# EAGLE schematic omicron2 (EAGLE 7.0.0)

## Sheet 1 of 5
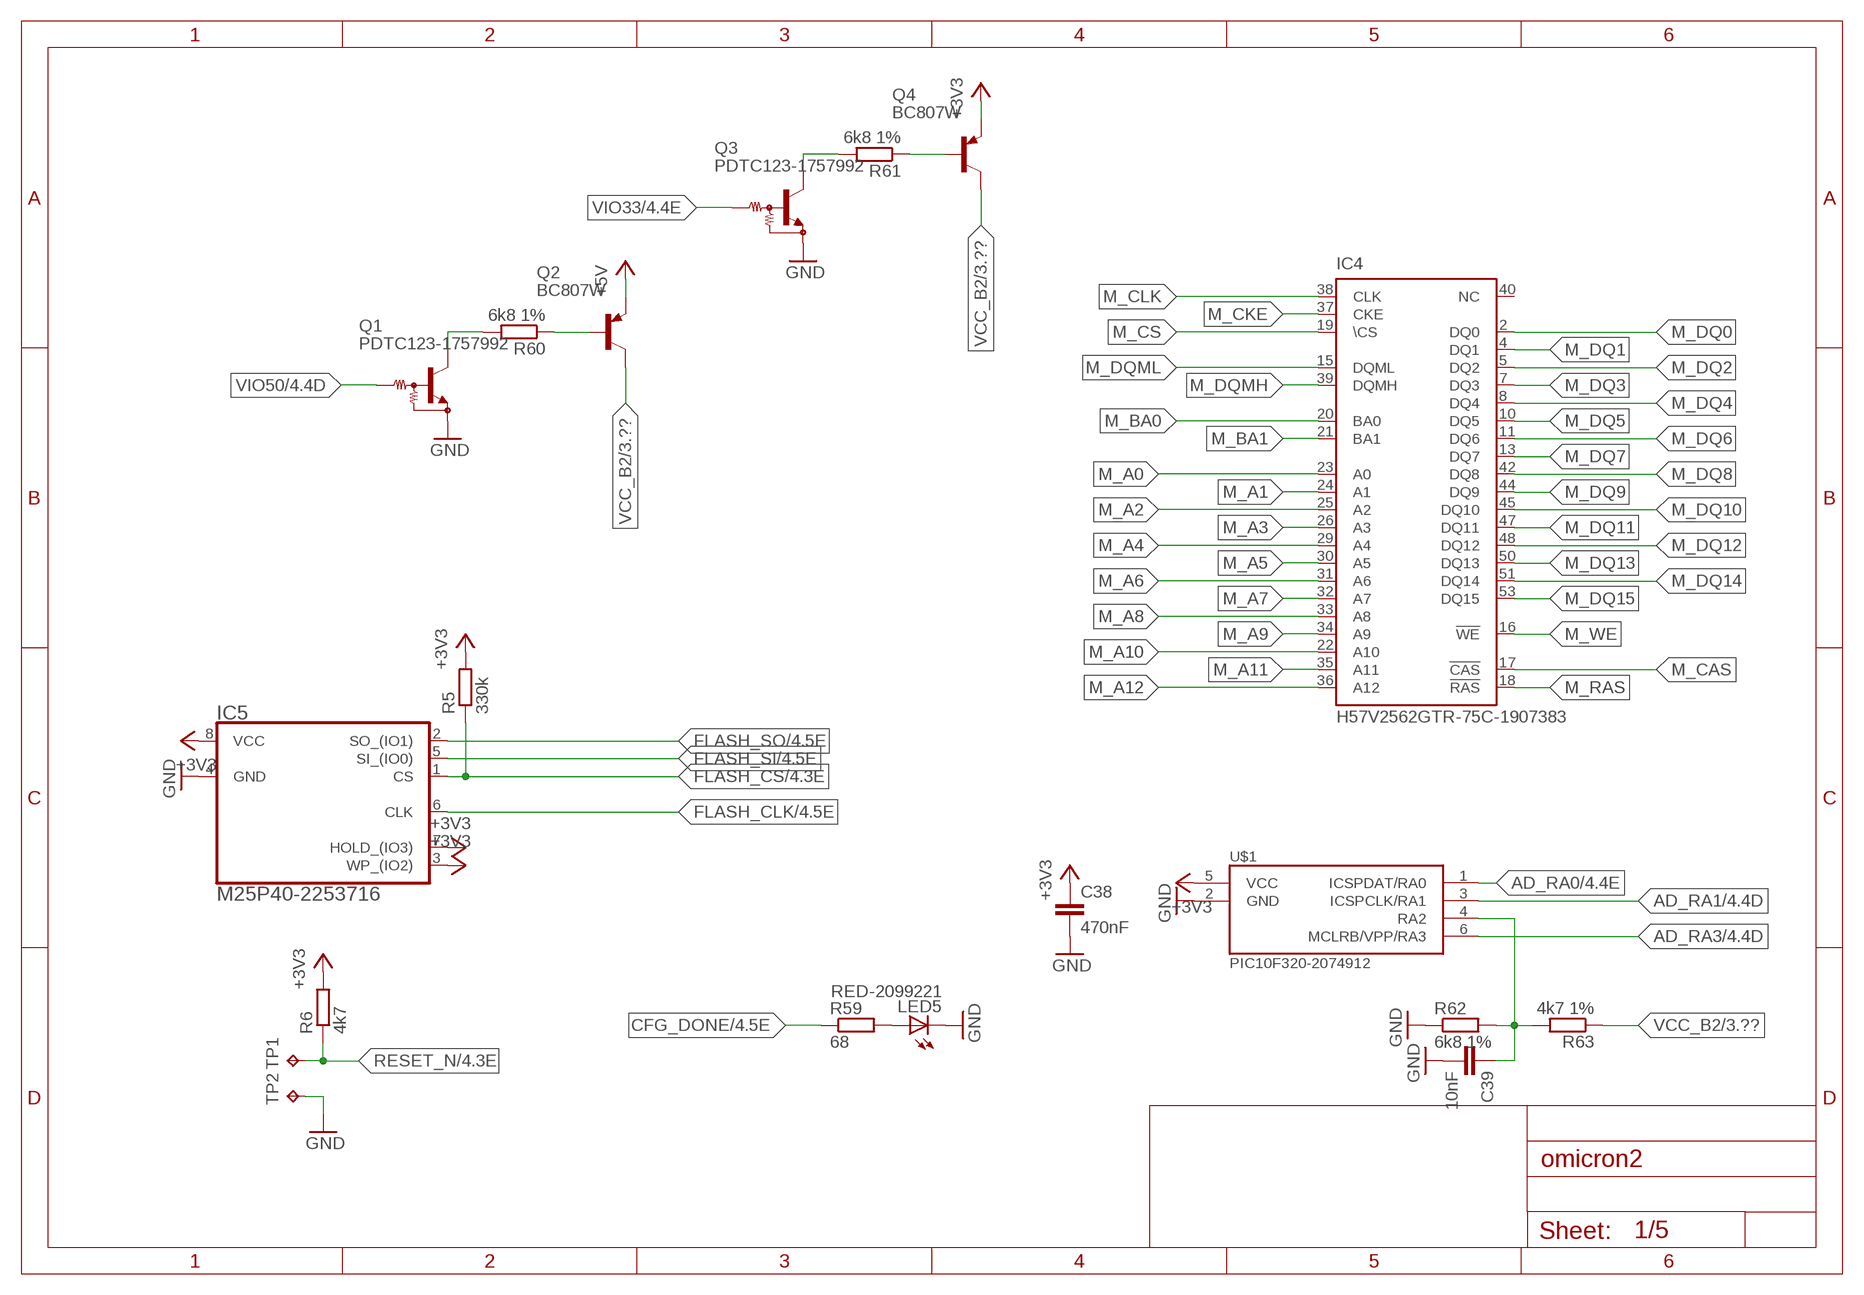
[diagram p0: schematic, sheet 1]

### Parts
C38  470nF  C-EUC0603  [C0603]
C39  10nF  C-EUC0603  [C0603]
IC4  H57V2562GTR-75C-1907383  MT48LC64M4A2  [TSOP54-400]
IC5  M25P40-2253716  FLASH  [SO8]
LED5  RED-2099221  LEDCHIPLED_0603  [CHIPLED_0603]
Q1  PDTC123-1757992  NPN-BIAS-SOT323-BEC  [SOT323]
Q2  BC807W  [SOT323-BEC]
Q3  PDTC123-1757992  NPN-BIAS-SOT323-BEC  [SOT323]
Q4  BC807W  [SOT323-BEC]
R5  330k  R-EU_R0603  [R0603]
R6  4k7  R-EU_R0603  [R0603]
R59  68  R-EU_R0603  [R0603]
R60  6k8 1%  R-EU_R0603  [R0603]
R61  6k8 1%  R-EU_R0603  [R0603]
R62  6k8 1%  R-EU_R0603  [R0603]
R63  4k7 1%  R-EU_R0603  [R0603]
TP1  TPTP15R  [TP15R]
TP2  TPTP20R  [TP20R]
U$1  PIC10F320-2074912  PIC10F320  [SOT23]

### Nets
+3V3: C38.1 IC5.3(WP_(IO2)) IC5.7(HOLD_(IO3)) IC5.8(VCC) Q4.2(E) R5.2 R6.2 U$1.5(VCC) ; also sheet 2,3,4,5
+5V: Q2.2(E) ; also sheet 2,3,5
AD_RA0: U$1.1(ICSPDAT/RA0) ; also sheet 4
AD_RA1: U$1.3(ICSPCLK/RA1) ; also sheet 4
AD_RA3: U$1.6(MCLRB/VPP/RA3) ; also sheet 4
CFG_DONE: R59.1 ; also sheet 4
FLASH_CLK: IC5.6(CLK) ; also sheet 4
FLASH_CS: IC5.1(CS) R5.1 ; also sheet 4
FLASH_SI: IC5.5(SI_(IO0)) ; also sheet 4
FLASH_SO: IC5.2(SO_(IO1)) ; also sheet 4
GND: C38.2 C39.2 IC5.4(GND) LED5.C Q1.2(E) Q3.2(E) R62.1 TP2.TP U$1.2(GND) ; also sheet 2,3,4,5
M_A0: IC4.23(A0) ; also sheet 4
M_A1: IC4.24(A1) ; also sheet 4
M_A2: IC4.25(A2) ; also sheet 4
M_A3: IC4.26(A3) ; also sheet 4
M_A4: IC4.29(A4) ; also sheet 4
M_A5: IC4.30(A5) ; also sheet 4
M_A6: IC4.31(A6) ; also sheet 4
M_A7: IC4.32(A7) ; also sheet 4
M_A8: IC4.33(A8) ; also sheet 4
M_A9: IC4.34(A9) ; also sheet 4
M_A10: IC4.22(A10) ; also sheet 4
M_A11: IC4.35(A11) ; also sheet 4
M_A12: IC4.36(A12) ; also sheet 4
M_BA0: IC4.20(BA0) ; also sheet 4
M_BA1: IC4.21(BA1) ; also sheet 4
M_CAS: IC4.17(!CAS) ; also sheet 4
M_CKE: IC4.37(CKE) ; also sheet 4
M_CLK: IC4.38(CLK) ; also sheet 4
M_CS: IC4.19(\CS) ; also sheet 4
M_DQ0: IC4.2(DQ0) ; also sheet 4
M_DQ1: IC4.4(DQ1) ; also sheet 4
M_DQ2: IC4.5(DQ2) ; also sheet 4
M_DQ3: IC4.7(DQ3) ; also sheet 4
M_DQ4: IC4.8(DQ4) ; also sheet 4
M_DQ5: IC4.10(DQ5) ; also sheet 4
M_DQ6: IC4.11(DQ6) ; also sheet 4
M_DQ7: IC4.13(DQ7) ; also sheet 4
M_DQ8: IC4.42(DQ8) ; also sheet 4
M_DQ9: IC4.44(DQ9) ; also sheet 4
M_DQ10: IC4.45(DQ10) ; also sheet 4
M_DQ11: IC4.47(DQ11) ; also sheet 4
M_DQ12: IC4.48(DQ12) ; also sheet 4
M_DQ13: IC4.50(DQ13) ; also sheet 4
M_DQ14: IC4.51(DQ14) ; also sheet 4
M_DQ15: IC4.53(DQ15) ; also sheet 4
M_DQMH: IC4.39(DQMH) ; also sheet 4
M_DQML: IC4.15(DQML) ; also sheet 4
M_RAS: IC4.18(!RAS) ; also sheet 4
M_WE: IC4.16(!WE) ; also sheet 4
N$4: LED5.A R59.2
N$7: Q2.1(B) R60.1
N$24: Q1.3(C) R60.2
N$25: Q4.1(B) R61.1
N$26: Q3.3(C) R61.2
N$27: C39.1 R62.2 R63.2 U$1.4(RA2)
RESET_N: R6.1 TP1.TP ; also sheet 4
VCC_B2: Q2.3(C) Q4.3(C) R63.1 ; also sheet 3
VIO33: Q3.1(B) ; also sheet 4
VIO50: Q1.1(B) ; also sheet 4
Unconnected: IC4.40(NC)

## Sheet 2 of 5
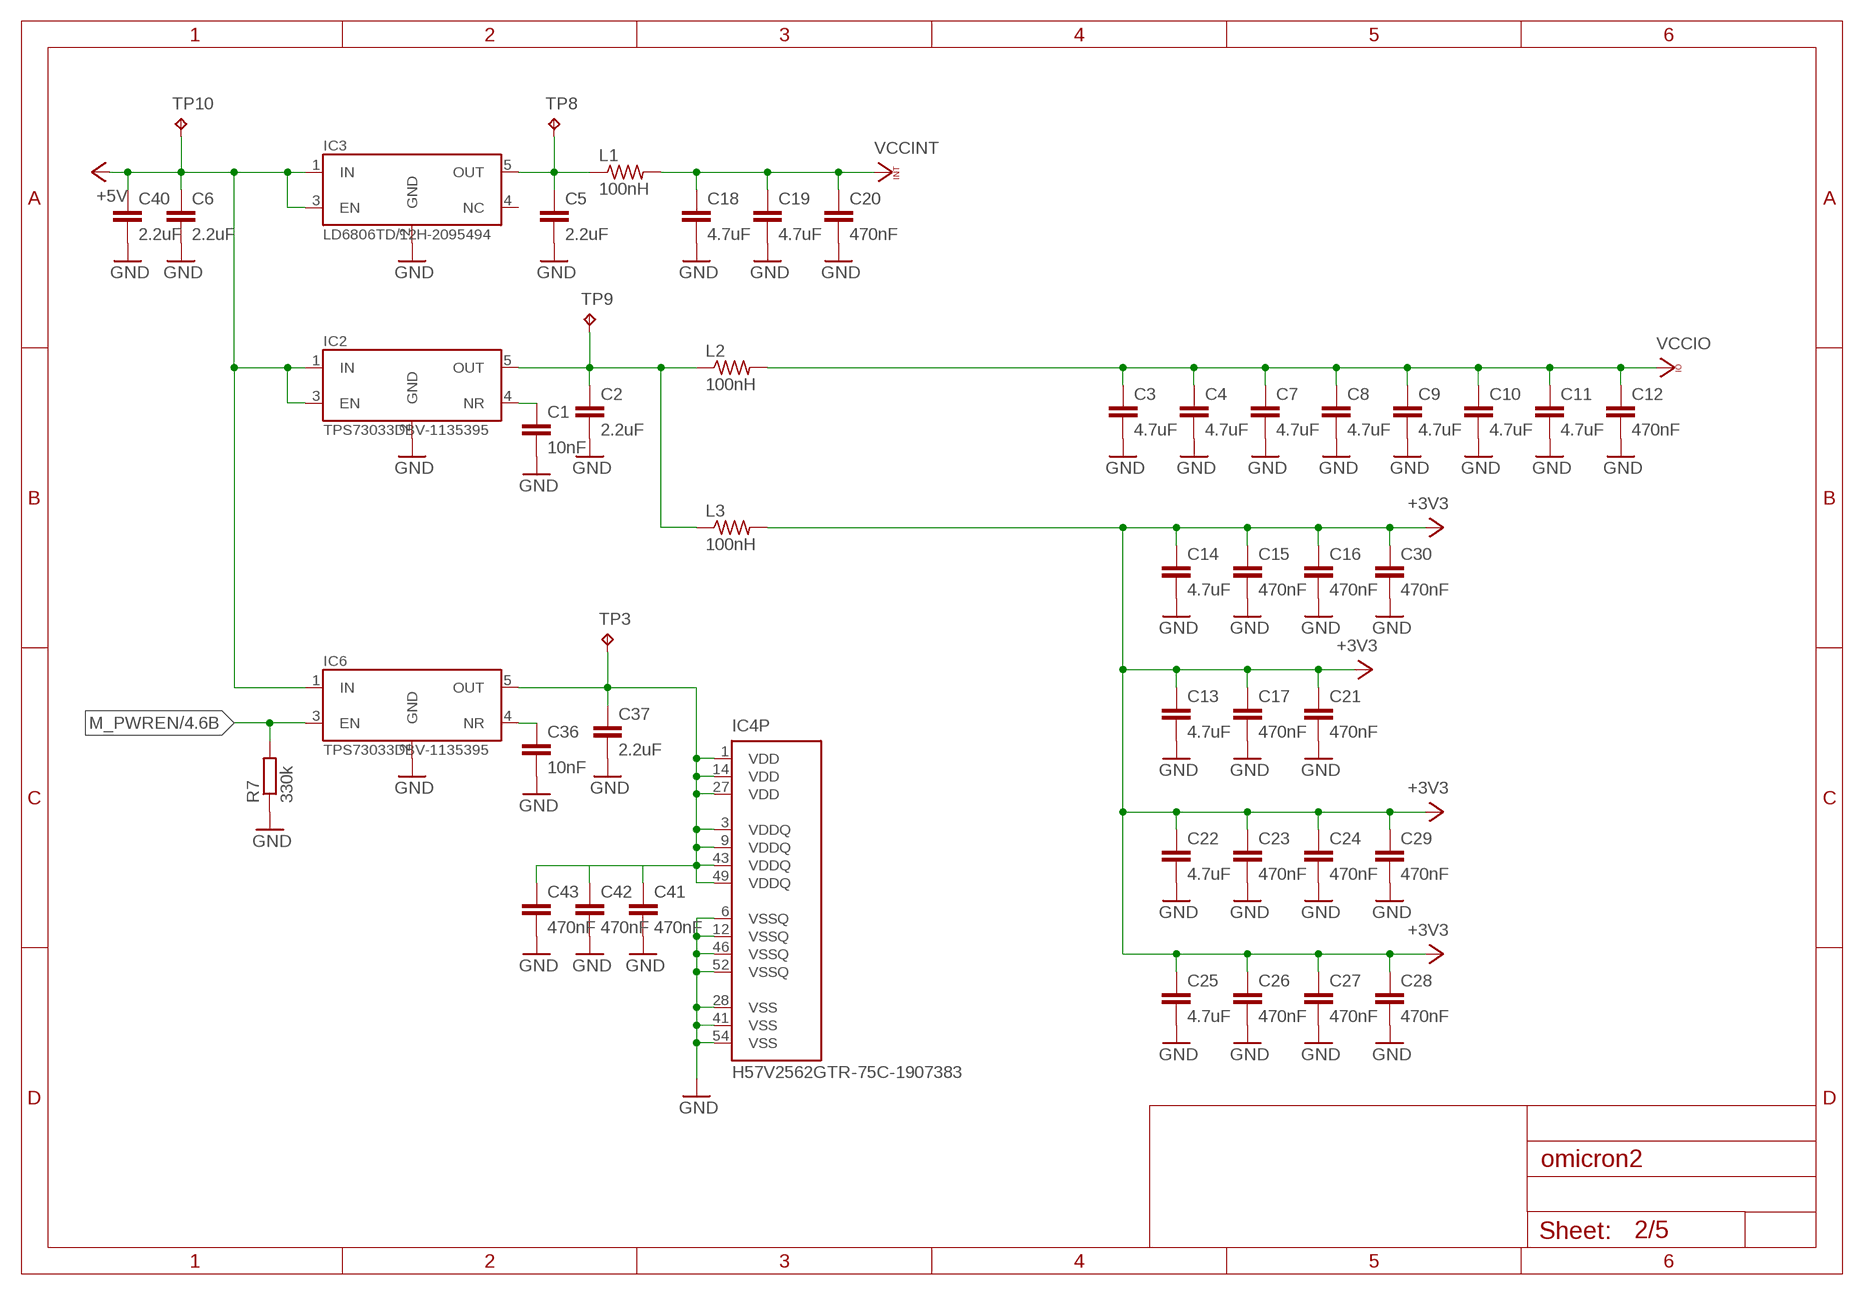
[diagram p1: schematic, sheet 2]

### Parts
C1  10nF  C-EUC0603  [C0603]
C2  2.2uF  C-EUC0603  [C0603]
C3  4.7uF  C-EUC0603  [C0603]
C4  4.7uF  C-EUC0603  [C0603]
C5  2.2uF  C-EUC0603  [C0603]
C6  2.2uF  C-EUC0603  [C0603]
C7  4.7uF  C-EUC0603  [C0603]
C8  4.7uF  C-EUC0603  [C0603]
C9  4.7uF  C-EUC0603  [C0603]
C10  4.7uF  C-EUC0603  [C0603]
C11  4.7uF  C-EUC0603  [C0603]
C12  470nF  C-EUC0603  [C0603]
C13  4.7uF  C-EUC0603  [C0603]
C14  4.7uF  C-EUC0603  [C0603]
C15  470nF  C-EUC0603  [C0603]
C16  470nF  C-EUC0603  [C0603]
C17  470nF  C-EUC0603  [C0603]
C18  4.7uF  C-EUC0603  [C0603]
C19  4.7uF  C-EUC0603  [C0603]
C20  470nF  C-EUC0603  [C0603]
C21  470nF  C-EUC0603  [C0603]
C22  4.7uF  C-EUC0603  [C0603]
C23  470nF  C-EUC0603  [C0603]
C24  470nF  C-EUC0603  [C0603]
C25  4.7uF  C-EUC0603  [C0603]
C26  470nF  C-EUC0603  [C0603]
C27  470nF  C-EUC0603  [C0603]
C28  470nF  C-EUC0603  [C0603]
C29  470nF  C-EUC0603  [C0603]
C30  470nF  C-EUC0603  [C0603]
C36  10nF  C-EUC0603  [C0603]
C37  2.2uF  C-EUC0603  [C0603]
C40  2.2uF  C-EUC0603  [C0603]
C41  470nF  C-EUC0603  [C0603]
C42  470nF  C-EUC0603  [C0603]
C43  470nF  C-EUC0603  [C0603]
IC2  TPS73033DBV-1135395  TPS73033DBV  [SOT23-DBV]
IC3  LD6806TD/12H-2095494  LD6806TD/12H  [SOT23-DBV]
IC6  TPS73033DBV-1135395  TPS73033DBV  [SOT23-DBV]
L1  100nH  R-US_R0805  [R0805]
L2  100nH  R-US_R0805  [R0805]
L3  100nH  R-US_R0805  [R0805]
R7  330k  R-EU_R0603  [R0603]
TP3  TPTP15R  [TP15R]
TP8  TPTP15R  [TP15R]
TP9  TPTP15R  [TP15R]
TP10  TPTP15R  [TP15R]

### Nets
+3V3: C13.1 C14.1 C15.1 C16.1 C17.1 C21.1 C22.1 C23.1 C24.1 C25.1 C26.1 C27.1 C28.1 C29.1 C30.1 L3.2 ; also sheet 1,3,4,5
+5V: C6.1 C40.1 IC2.1(IN) IC2.3(EN) IC3.1(IN) IC3.3(EN) IC6.1(IN) TP10.TP ; also sheet 1,3,5
GND: C1.2 C2.2 C3.2 C4.2 C5.2 C6.2 C7.2 C8.2 C9.2 C10.2 C11.2 C12.2 C13.2 C14.2 C15.2 C16.2 C17.2 C18.2 C19.2 C20.2 C21.2 C22.2 C23.2 C24.2 C25.2 C26.2 C27.2 C28.2 C29.2 C30.2 C36.2 C37.2 C40.2 C41.2 C42.2 C43.2 IC2.2(GND) IC3.2(GND) IC4.6(VSSQ) IC4.12(VSSQ) IC4.28(VSS) IC4.41(VSS) IC4.46(VSSQ) IC4.52(VSSQ) IC4.54(VSS) IC6.2(GND) R7.1 ; also sheet 1,3,4,5
M_PWREN: IC6.3(EN) R7.2 ; also sheet 4
N$1: C1.1 IC2.4(NR)
N$2: C5.1 IC3.5(OUT) L1.1 TP8.TP
N$3: C2.1 IC2.5(OUT) L2.1 L3.1 TP9.TP
N$6: C36.1 IC6.4(NR)
VCC_MEM: C37.1 C41.1 C42.1 C43.1 IC4.1(VDD) IC4.3(VDDQ) IC4.9(VDDQ) IC4.14(VDD) IC4.27(VDD) IC4.43(VDDQ) IC4.49(VDDQ) IC6.5(OUT) TP3.TP
VCCINT: C18.1 C19.1 C20.1 L1.2 ; also sheet 4
VCCIO: C3.1 C4.1 C7.1 C8.1 C9.1 C10.1 C11.1 C12.1 L2.2 ; also sheet 4
Unconnected: IC3.4(NC)

## Sheet 3 of 5
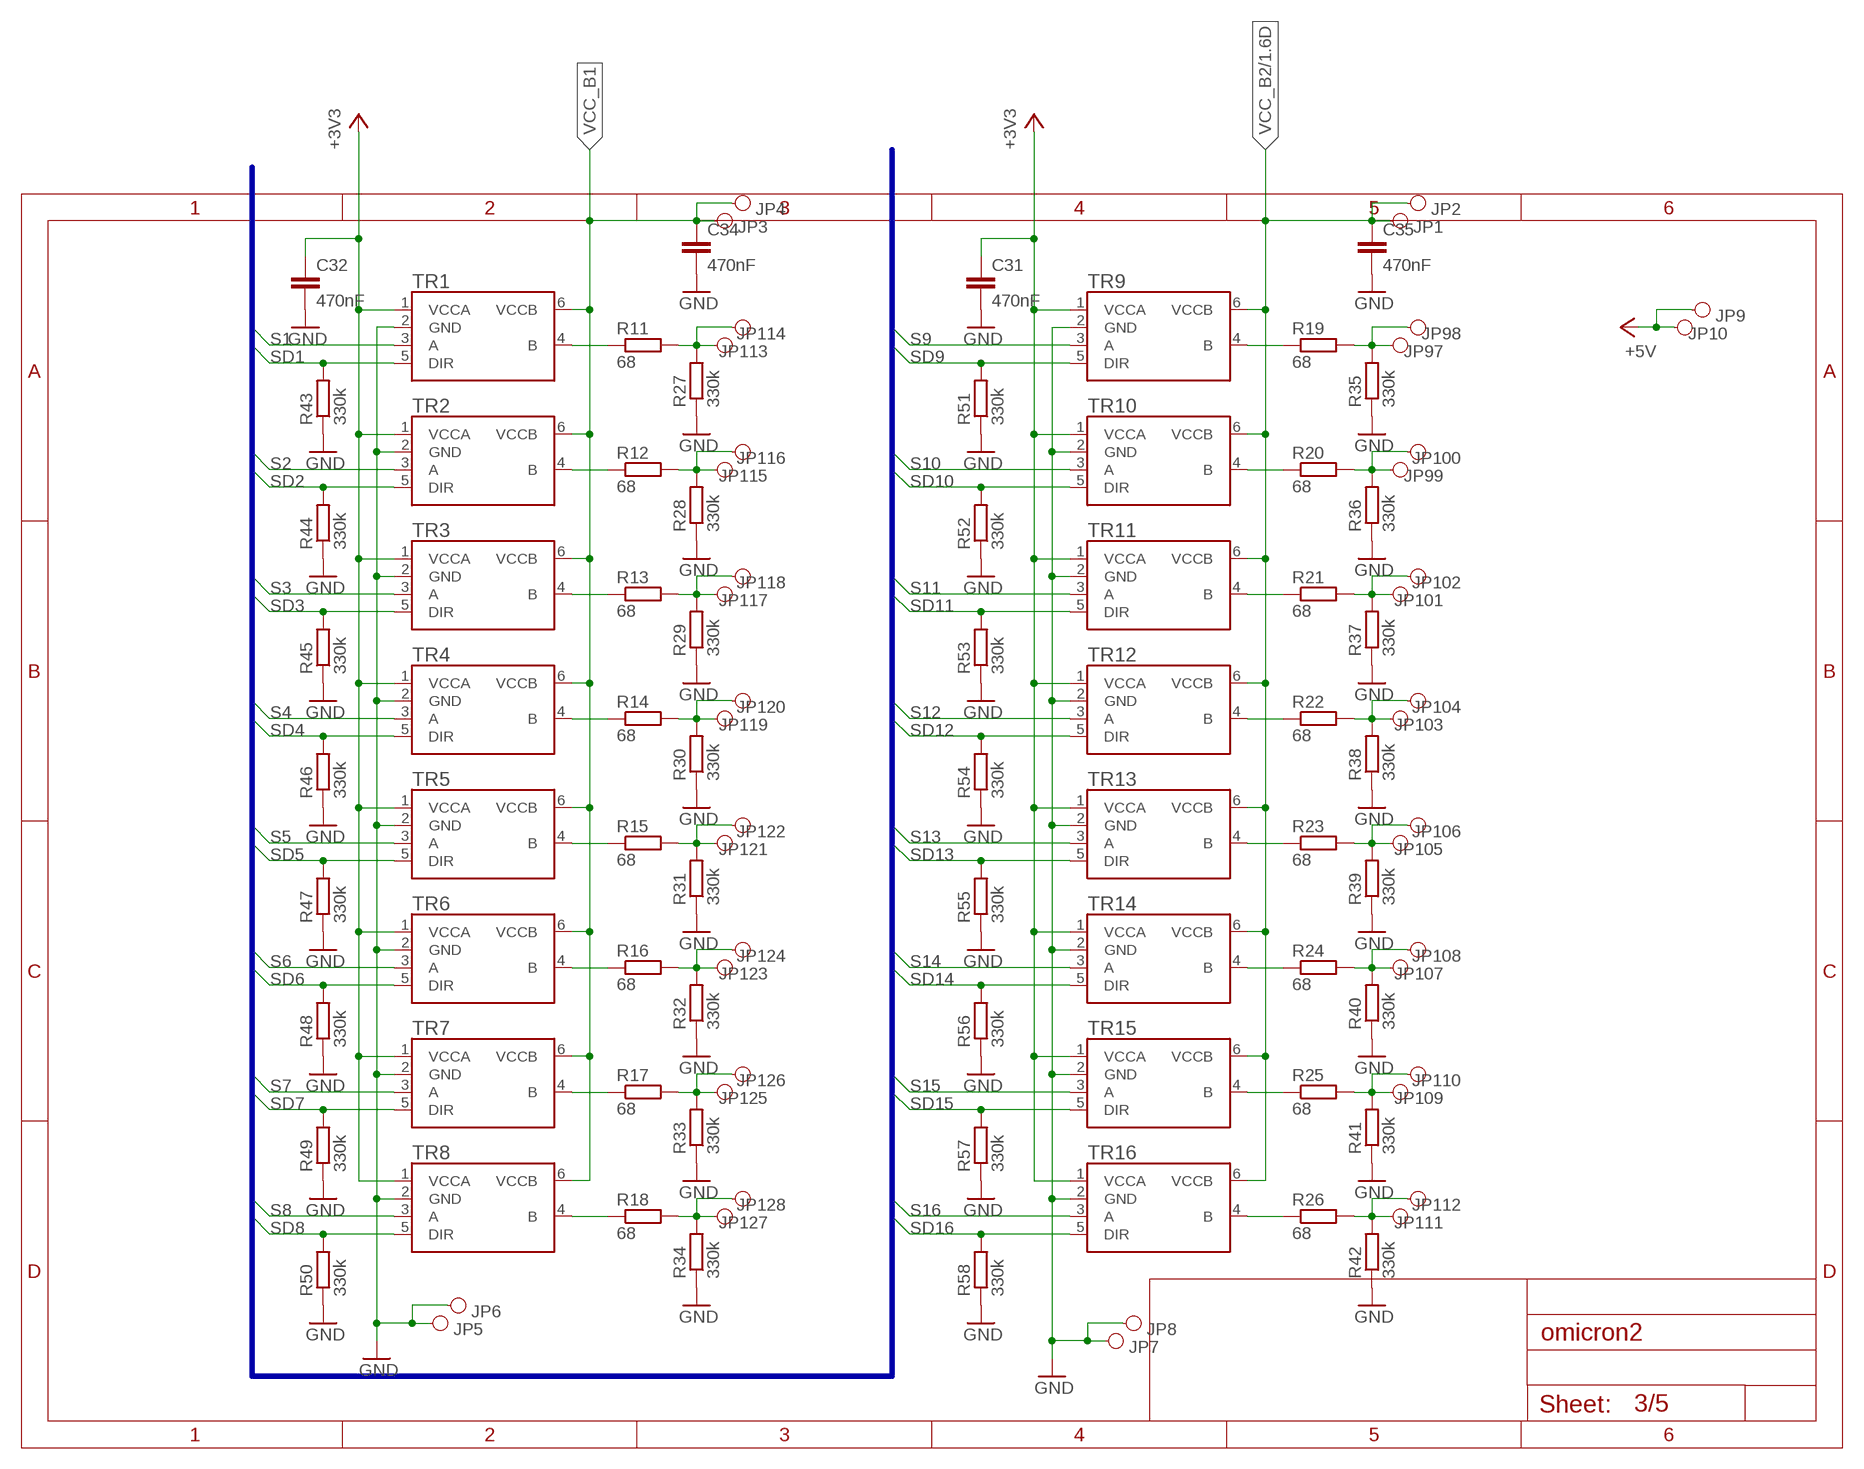
[diagram p2: schematic, sheet 3]

### Parts
C31  470nF  C-EUC0603  [C0603]
C32  470nF  C-EUC0603  [C0603]
C34  470nF  C-EUC0603  [C0603]
C35  470nF  C-EUC0603  [C0603]
JP1  PINH1X01SMD  [PINH1X01SMD]
JP2  PINH1X01SMD  [PINH1X01SMD]
JP3  PINH1X01SMD  [PINH1X01SMD]
JP4  PINH1X01SMD  [PINH1X01SMD]
JP5  PINH1X01SMD  [PINH1X01SMD]
JP6  PINH1X01SMD  [PINH1X01SMD]
JP7  PINH1X01SMD  [PINH1X01SMD]
JP8  PINH1X01SMD  [PINH1X01SMD]
JP9  PINH1X01SMD  [PINH1X01SMD]
JP10  PINH1X01SMD  [PINH1X01SMD]
JP97  PINH1X01SMD  [PINH1X01SMD]
JP98  PINH1X01SMD  [PINH1X01SMD]
JP99  PINH1X01SMD  [PINH1X01SMD]
JP100  PINH1X01SMD  [PINH1X01SMD]
JP101  PINH1X01SMD  [PINH1X01SMD]
JP102  PINH1X01SMD  [PINH1X01SMD]
JP103  PINH1X01SMD  [PINH1X01SMD]
JP104  PINH1X01SMD  [PINH1X01SMD]
JP105  PINH1X01SMD  [PINH1X01SMD]
JP106  PINH1X01SMD  [PINH1X01SMD]
JP107  PINH1X01SMD  [PINH1X01SMD]
JP108  PINH1X01SMD  [PINH1X01SMD]
JP109  PINH1X01SMD  [PINH1X01SMD]
JP110  PINH1X01SMD  [PINH1X01SMD]
JP111  PINH1X01SMD  [PINH1X01SMD]
JP112  PINH1X01SMD  [PINH1X01SMD]
JP113  PINH1X01SMD  [PINH1X01SMD]
JP114  PINH1X01SMD  [PINH1X01SMD]
JP115  PINH1X01SMD  [PINH1X01SMD]
JP116  PINH1X01SMD  [PINH1X01SMD]
JP117  PINH1X01SMD  [PINH1X01SMD]
JP118  PINH1X01SMD  [PINH1X01SMD]
JP119  PINH1X01SMD  [PINH1X01SMD]
JP120  PINH1X01SMD  [PINH1X01SMD]
JP121  PINH1X01SMD  [PINH1X01SMD]
JP122  PINH1X01SMD  [PINH1X01SMD]
JP123  PINH1X01SMD  [PINH1X01SMD]
JP124  PINH1X01SMD  [PINH1X01SMD]
JP125  PINH1X01SMD  [PINH1X01SMD]
JP126  PINH1X01SMD  [PINH1X01SMD]
JP127  PINH1X01SMD  [PINH1X01SMD]
JP128  PINH1X01SMD  [PINH1X01SMD]
R11  68  R-EU_R0603  [R0603]
R12  68  R-EU_R0603  [R0603]
R13  68  R-EU_R0603  [R0603]
R14  68  R-EU_R0603  [R0603]
R15  68  R-EU_R0603  [R0603]
R16  68  R-EU_R0603  [R0603]
R17  68  R-EU_R0603  [R0603]
R18  68  R-EU_R0603  [R0603]
R19  68  R-EU_R0603  [R0603]
R20  68  R-EU_R0603  [R0603]
R21  68  R-EU_R0603  [R0603]
R22  68  R-EU_R0603  [R0603]
R23  68  R-EU_R0603  [R0603]
R24  68  R-EU_R0603  [R0603]
R25  68  R-EU_R0603  [R0603]
R26  68  R-EU_R0603  [R0603]
R27  330k  R-EU_R0603  [R0603]
R28  330k  R-EU_R0603  [R0603]
R29  330k  R-EU_R0603  [R0603]
R30  330k  R-EU_R0603  [R0603]
R31  330k  R-EU_R0603  [R0603]
R32  330k  R-EU_R0603  [R0603]
R33  330k  R-EU_R0603  [R0603]
R34  330k  R-EU_R0603  [R0603]
R35  330k  R-EU_R0603  [R0603]
R36  330k  R-EU_R0603  [R0603]
R37  330k  R-EU_R0603  [R0603]
R38  330k  R-EU_R0603  [R0603]
R39  330k  R-EU_R0603  [R0603]
R40  330k  R-EU_R0603  [R0603]
R41  330k  R-EU_R0603  [R0603]
R42  330k  R-EU_R0603  [R0603]
R43  330k  R-EU_R0603  [R0603]
R44  330k  R-EU_R0603  [R0603]
R45  330k  R-EU_R0603  [R0603]
R46  330k  R-EU_R0603  [R0603]
R47  330k  R-EU_R0603  [R0603]
R48  330k  R-EU_R0603  [R0603]
R49  330k  R-EU_R0603  [R0603]
R50  330k  R-EU_R0603  [R0603]
R51  330k  R-EU_R0603  [R0603]
R52  330k  R-EU_R0603  [R0603]
R53  330k  R-EU_R0603  [R0603]
R54  330k  R-EU_R0603  [R0603]
R55  330k  R-EU_R0603  [R0603]
R56  330k  R-EU_R0603  [R0603]
R57  330k  R-EU_R0603  [R0603]
R58  330k  R-EU_R0603  [R0603]
TR1  74LVC1T45DBV  [SOT236]
TR2  74LVC1T45DBV  [SOT236]
TR3  74LVC1T45DBV  [SOT236]
TR4  74LVC1T45DBV  [SOT236]
TR5  74LVC1T45DBV  [SOT236]
TR6  74LVC1T45DBV  [SOT236]
TR7  74LVC1T45DBV  [SOT236]
TR8  74LVC1T45DBV  [SOT236]
TR9  74LVC1T45DBV  [SOT236]
TR10  74LVC1T45DBV  [SOT236]
TR11  74LVC1T45DBV  [SOT236]
TR12  74LVC1T45DBV  [SOT236]
TR13  74LVC1T45DBV  [SOT236]
TR14  74LVC1T45DBV  [SOT236]
TR15  74LVC1T45DBV  [SOT236]
TR16  74LVC1T45DBV  [SOT236]

### Nets
+3V3: C31.1 C32.1 TR1.1(VCCA) TR2.1(VCCA) TR3.1(VCCA) TR4.1(VCCA) TR5.1(VCCA) TR6.1(VCCA) TR7.1(VCCA) TR8.1(VCCA) TR9.1(VCCA) TR10.1(VCCA) TR11.1(VCCA) TR12.1(VCCA) TR13.1(VCCA) TR14.1(VCCA) TR15.1(VCCA) TR16.1(VCCA) ; also sheet 1,2,4,5
+5V: JP9.1 JP10.1 ; also sheet 1,2,5
GND: C31.2 C32.2 C34.2 C35.2 JP5.1 JP6.1 JP7.1 JP8.1 R27.1 R28.1 R29.1 R30.1 R31.1 R32.1 R33.1 R34.1 R35.1 R36.1 R37.1 R38.1 R39.1 R40.1 R41.1 R42.1 R43.1 R44.1 R45.1 R46.1 R47.1 R48.1 R49.1 R50.1 R51.1 R52.1 R53.1 R54.1 R55.1 R56.1 R57.1 R58.1 TR1.2(GND) TR2.2(GND) TR3.2(GND) TR4.2(GND) TR5.2(GND) TR6.2(GND) TR7.2(GND) TR8.2(GND) TR9.2(GND) TR10.2(GND) TR11.2(GND) TR12.2(GND) TR13.2(GND) TR14.2(GND) TR15.2(GND) TR16.2(GND) ; also sheet 1,2,4,5
IO1: JP113.1 JP114.1 R11.2 R27.2
IO2: JP115.1 JP116.1 R12.2 R28.2
IO3: JP117.1 JP118.1 R13.2 R29.2
IO4: JP119.1 JP120.1 R14.2 R30.2
IO5: JP121.1 JP122.1 R15.2 R31.2
IO6: JP123.1 JP124.1 R16.2 R32.2
IO7: JP125.1 JP126.1 R17.2 R33.2
IO8: JP127.1 JP128.1 R18.2 R34.2
IO9: JP97.1 JP98.1 R19.2 R35.2
IO10: JP99.1 JP100.1 R20.2 R36.2
IO11: JP101.1 JP102.1 R21.2 R37.2
IO12: JP103.1 JP104.1 R22.2 R38.2
IO13: JP105.1 JP106.1 R23.2 R39.2
IO14: JP107.1 JP108.1 R24.2 R40.2
IO15: JP109.1 JP110.1 R25.2 R41.2
IO16: JP111.1 JP112.1 R26.2 R42.2
N$8: R11.1 TR1.4(B)
N$9: R12.1 TR2.4(B)
N$10: R13.1 TR3.4(B)
N$11: R14.1 TR4.4(B)
N$12: R15.1 TR5.4(B)
N$13: R16.1 TR6.4(B)
N$14: R17.1 TR7.4(B)
N$15: R18.1 TR8.4(B)
N$16: R19.1 TR9.4(B)
N$17: R20.1 TR10.4(B)
N$18: R21.1 TR11.4(B)
N$19: R22.1 TR12.4(B)
N$20: R23.1 TR13.4(B)
N$21: R24.1 TR14.4(B)
N$22: R25.1 TR15.4(B)
N$23: R26.1 TR16.4(B)
S1: TR1.3(A) ; also sheet 4
S2: TR2.3(A) ; also sheet 4
S3: TR3.3(A) ; also sheet 4
S4: TR4.3(A) ; also sheet 4
S5: TR5.3(A) ; also sheet 4
S6: TR6.3(A) ; also sheet 4
S7: TR7.3(A) ; also sheet 4
S8: TR8.3(A) ; also sheet 4
S9: TR9.3(A) ; also sheet 4
S10: TR10.3(A) ; also sheet 4
S11: TR11.3(A) ; also sheet 4
S12: TR12.3(A) ; also sheet 4
S13: TR13.3(A) ; also sheet 4
S14: TR14.3(A) ; also sheet 4
S15: TR15.3(A) ; also sheet 4
S16: TR16.3(A) ; also sheet 4
SD1: R43.2 TR1.5(DIR) ; also sheet 4
SD2: R44.2 TR2.5(DIR) ; also sheet 4
SD3: R45.2 TR3.5(DIR) ; also sheet 4
SD4: R46.2 TR4.5(DIR) ; also sheet 4
SD5: R47.2 TR5.5(DIR) ; also sheet 4
SD6: R48.2 TR6.5(DIR) ; also sheet 4
SD7: R49.2 TR7.5(DIR) ; also sheet 4
SD8: R50.2 TR8.5(DIR) ; also sheet 4
SD9: R51.2 TR9.5(DIR) ; also sheet 4
SD10: R52.2 TR10.5(DIR) ; also sheet 4
SD11: R53.2 TR11.5(DIR) ; also sheet 4
SD12: R54.2 TR12.5(DIR) ; also sheet 4
SD13: R55.2 TR13.5(DIR) ; also sheet 4
SD14: R56.2 TR14.5(DIR) ; also sheet 4
SD15: R57.2 TR15.5(DIR) ; also sheet 4
SD16: R58.2 TR16.5(DIR) ; also sheet 4
VCC_B1: C34.1 JP3.1 JP4.1 TR1.6(VCCB) TR2.6(VCCB) TR3.6(VCCB) TR4.6(VCCB) TR5.6(VCCB) TR6.6(VCCB) TR7.6(VCCB) TR8.6(VCCB)
VCC_B2: C35.1 JP1.1 JP2.1 TR9.6(VCCB) TR10.6(VCCB) TR11.6(VCCB) TR12.6(VCCB) TR13.6(VCCB) TR14.6(VCCB) TR15.6(VCCB) TR16.6(VCCB) ; also sheet 1

### Buses
S[1..16],SD[1..16]

## Sheet 4 of 5
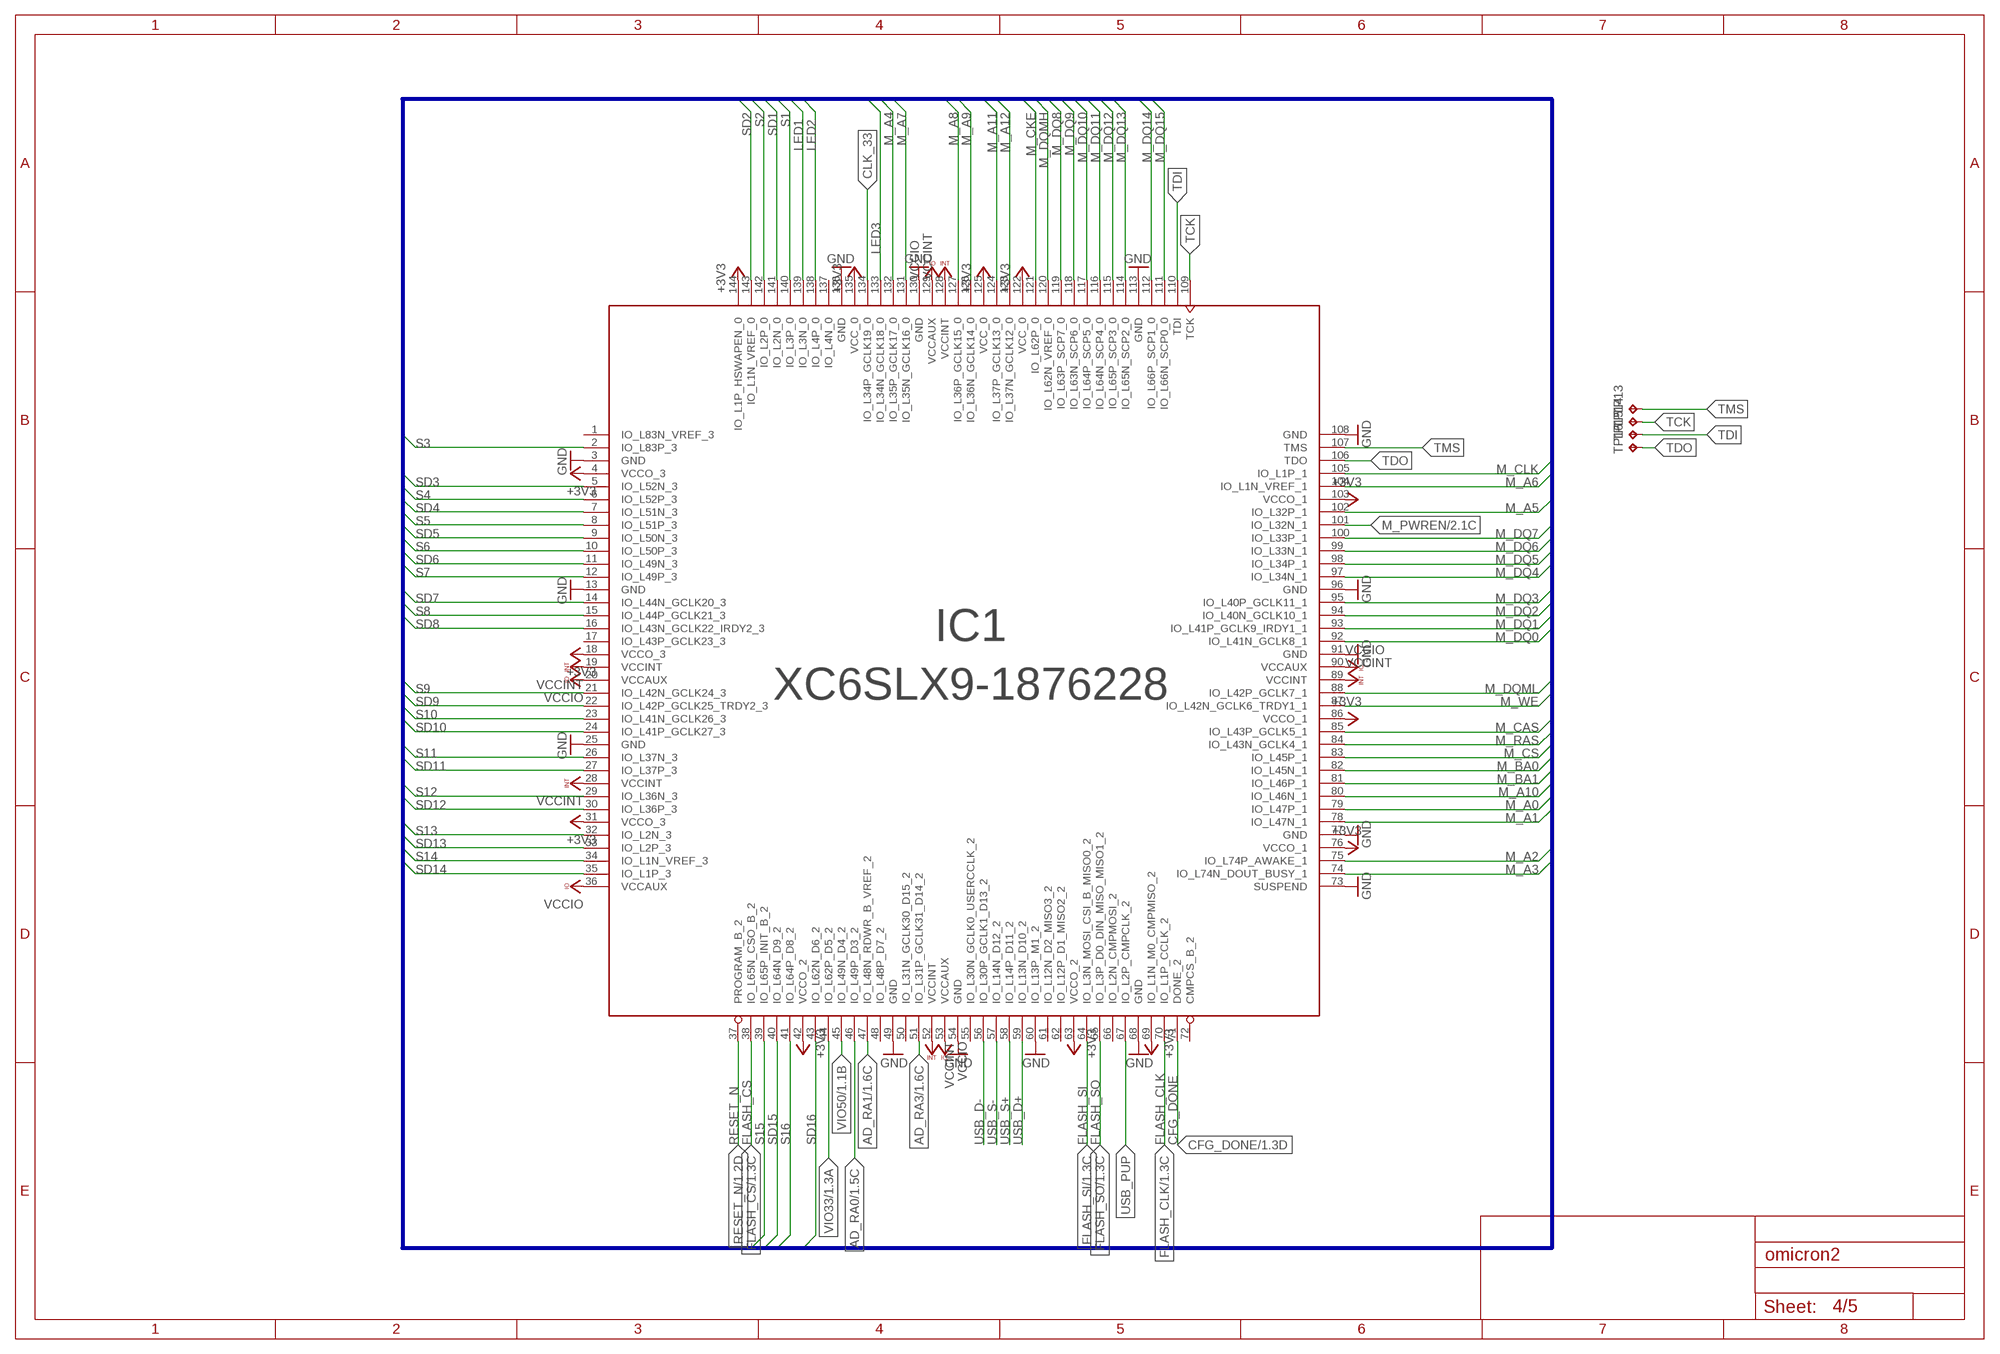
[diagram p3: schematic, sheet 4]

### Parts
IC1  XC6SLX9-1876228  XC6SLX4-2TQG144  [TQG144]
TP13  TPTP20R  [TP20R]
TP14  TPTP20R  [TP20R]
TP15  TPTP20R  [TP20R]
TP16  TPTP20R  [TP20R]

### Nets
+3V3: IC1.4(VCCO_3) IC1.18(VCCO_3) IC1.31(VCCO_3) IC1.42(VCCO_2) IC1.63(VCCO_2) IC1.69(IO_L1N_M0_CMPMISO_2) IC1.76(VCCO_1) IC1.86(VCCO_1) IC1.103(VCCO_1) IC1.122(VCC_0) IC1.125(VCC_0) IC1.135(VCC_0) IC1.144(IO_L1P_HSWAPEN_0) ; also sheet 1,2,3,5
AD_RA0: IC1.46(IO_L49P_D3_2) ; also sheet 1
AD_RA1: IC1.47(IO_L48N_RDWR_B_VREF_2) ; also sheet 1
AD_RA3: IC1.51(IO_L31P_GCLK31_D14_2) ; also sheet 1
CFG_DONE: IC1.71(DONE_2) ; also sheet 1
CLK_33: IC1.134(IO_L34P_GCLK19_0) ; also sheet 5
FLASH_CLK: IC1.70(IO_L1P_CCLK_2) ; also sheet 1
FLASH_CS: IC1.38(IO_L65N_CSO_B_2) ; also sheet 1
FLASH_SI: IC1.64(IO_L3N_MOSI_CSI_B_MISO0_2) ; also sheet 1
FLASH_SO: IC1.65(IO_L3P_D0_DIN_MISO_MISO1_2) ; also sheet 1
GND: IC1.3(GND) IC1.13(GND) IC1.25(GND) IC1.49(GND) IC1.54(GND) IC1.60(IO_L13P_M1_2) IC1.68(GND) IC1.73(SUSPEND) IC1.77(GND) IC1.91(GND) IC1.96(GND) IC1.108(GND) IC1.113(GND) IC1.130(GND) IC1.136(GND) ; also sheet 1,2,3,5
LED1: IC1.139(IO_L3N_0) ; also sheet 5
LED2: IC1.138(IO_L4P_0) ; also sheet 5
LED3: IC1.133(IO_L34N_GCLK18_0) ; also sheet 5
M_A0: IC1.79(IO_L47P_1) ; also sheet 1
M_A1: IC1.78(IO_L47N_1) ; also sheet 1
M_A2: IC1.75(IO_L74P_AWAKE_1) ; also sheet 1
M_A3: IC1.74(IO_L74N_DOUT_BUSY_1) ; also sheet 1
M_A4: IC1.132(IO_L35P_GCLK17_0) ; also sheet 1
M_A5: IC1.102(IO_L32P_1) ; also sheet 1
M_A6: IC1.104(IO_L1N_VREF_1) ; also sheet 1
M_A7: IC1.131(IO_L35N_GCLK16_0) ; also sheet 1
M_A8: IC1.127(IO_L36P_GCLK15_0) ; also sheet 1
M_A9: IC1.126(IO_L36N_GCLK14_0) ; also sheet 1
M_A10: IC1.80(IO_L46N_1) ; also sheet 1
M_A11: IC1.124(IO_L37P_GCLK13_0) ; also sheet 1
M_A12: IC1.123(IO_L37N_GCLK12_0) ; also sheet 1
M_BA0: IC1.82(IO_L45N_1) ; also sheet 1
M_BA1: IC1.81(IO_L46P_1) ; also sheet 1
M_CAS: IC1.85(IO_L43P_GCLK5_1) ; also sheet 1
M_CKE: IC1.121(IO_L62P_0) ; also sheet 1
M_CLK: IC1.105(IO_L1P_1) ; also sheet 1
M_CS: IC1.83(IO_L45P_1) ; also sheet 1
M_DQ0: IC1.92(IO_L41N_GCLK8_1) ; also sheet 1
M_DQ1: IC1.93(IO_L41P_GCLK9_IRDY1_1) ; also sheet 1
M_DQ2: IC1.94(IO_L40N_GCLK10_1) ; also sheet 1
M_DQ3: IC1.95(IO_L40P_GCLK11_1) ; also sheet 1
M_DQ4: IC1.97(IO_L34N_1) ; also sheet 1
M_DQ5: IC1.98(IO_L34P_1) ; also sheet 1
M_DQ6: IC1.99(IO_L33N_1) ; also sheet 1
M_DQ7: IC1.100(IO_L33P_1) ; also sheet 1
M_DQ8: IC1.119(IO_L63P_SCP7_0) ; also sheet 1
M_DQ9: IC1.118(IO_L63N_SCP6_0) ; also sheet 1
M_DQ10: IC1.117(IO_L64P_SCP5_0) ; also sheet 1
M_DQ11: IC1.116(IO_L64N_SCP4_0) ; also sheet 1
M_DQ12: IC1.115(IO_L65P_SCP3_0) ; also sheet 1
M_DQ13: IC1.114(IO_L65N_SCP2_0) ; also sheet 1
M_DQ14: IC1.112(IO_L66P_SCP1_0) ; also sheet 1
M_DQ15: IC1.111(IO_L66N_SCP0_0) ; also sheet 1
M_DQMH: IC1.120(IO_L62N_VREF_0) ; also sheet 1
M_DQML: IC1.88(IO_L42P_GCLK7_1) ; also sheet 1
M_PWREN: IC1.101(IO_L32N_1) ; also sheet 2
M_RAS: IC1.84(IO_L43N_GCLK4_1) ; also sheet 1
M_WE: IC1.87(IO_L42N_GCLK6_TRDY1_1) ; also sheet 1
RESET_N: IC1.37(PROGRAM_B_2) ; also sheet 1
S1: IC1.140(IO_L3P_0) ; also sheet 3
S2: IC1.142(IO_L2P_0) ; also sheet 3
S3: IC1.2(IO_L83P_3) ; also sheet 3
S4: IC1.6(IO_L52P_3) ; also sheet 3
S5: IC1.8(IO_L51P_3) ; also sheet 3
S6: IC1.10(IO_L50P_3) ; also sheet 3
S7: IC1.12(IO_L49P_3) ; also sheet 3
S8: IC1.15(IO_L44P_GCLK21_3) ; also sheet 3
S9: IC1.21(IO_L42N_GCLK24_3) ; also sheet 3
S10: IC1.23(IO_L41N_GCLK26_3) ; also sheet 3
S11: IC1.26(IO_L37N_3) ; also sheet 3
S12: IC1.29(IO_L36N_3) ; also sheet 3
S13: IC1.32(IO_L2N_3) ; also sheet 3
S14: IC1.34(IO_L1N_VREF_3) ; also sheet 3
S15: IC1.39(IO_L65P_INIT_B_2) ; also sheet 3
S16: IC1.41(IO_L64P_D8_2) ; also sheet 3
SD1: IC1.141(IO_L2N_0) ; also sheet 3
SD2: IC1.143(IO_L1N_VREF_0) ; also sheet 3
SD3: IC1.5(IO_L52N_3) ; also sheet 3
SD4: IC1.7(IO_L51N_3) ; also sheet 3
SD5: IC1.9(IO_L50N_3) ; also sheet 3
SD6: IC1.11(IO_L49N_3) ; also sheet 3
SD7: IC1.14(IO_L44N_GCLK20_3) ; also sheet 3
SD8: IC1.16(IO_L43N_GCLK22_IRDY2_3) ; also sheet 3
SD9: IC1.22(IO_L42P_GCLK25_TRDY2_3) ; also sheet 3
SD10: IC1.24(IO_L41P_GCLK27_3) ; also sheet 3
SD11: IC1.27(IO_L37P_3) ; also sheet 3
SD12: IC1.30(IO_L36P_3) ; also sheet 3
SD13: IC1.33(IO_L2P_3) ; also sheet 3
SD14: IC1.35(IO_L1P_3) ; also sheet 3
SD15: IC1.40(IO_L64N_D9_2) ; also sheet 3
SD16: IC1.43(IO_L62N_D6_2) ; also sheet 3
TCK: IC1.109(TCK) TP14.TP
TDI: IC1.110(TDI) TP15.TP
TDO: IC1.106(TDO) TP16.TP
TMS: IC1.107(TMS) TP13.TP
USB_D+: IC1.59(IO_L13N_D10_2) ; also sheet 5
USB_D-: IC1.56(IO_L30P_GCLK1_D13_2) ; also sheet 5
USB_PUP: IC1.67(IO_L2P_CMPCLK_2) ; also sheet 5
USB_S+: IC1.58(IO_L14P_D11_2) ; also sheet 5
USB_S-: IC1.57(IO_L14N_D12_2) ; also sheet 5
VCCINT: IC1.19(VCCINT) IC1.28(VCCINT) IC1.52(VCCINT) IC1.89(VCCINT) IC1.128(VCCINT) ; also sheet 2
VCCIO: IC1.20(VCCAUX) IC1.36(VCCAUX) IC1.53(VCCAUX) IC1.90(VCCAUX) IC1.129(VCCAUX) ; also sheet 2
VIO33: IC1.44(IO_L62P_D5_2) ; also sheet 1
VIO50: IC1.45(IO_L49N_D4_2) ; also sheet 1
Unconnected: IC1.1(IO_L83N_VREF_3) IC1.17(IO_L43P_GCLK23_3) IC1.48(IO_L48P_D7_2) IC1.50(IO_L31N_GCLK30_D15_2) IC1.55(IO_L30N_GCLK0_USERCCLK_2) IC1.61(IO_L12N_D2_MISO3_2) IC1.62(IO_L12P_D1_MISO2_2) IC1.66(IO_L2N_CMPMOSI_2) IC1.72(CMPCS_B_2) IC1.137(IO_L4N_0)

### Buses
M_A[0..12],M_BA[0..1],M_CAS,M_RAS,M_WE,M_CS,M_DQ[0..15],M_CLK,M_CKE,S[1..16],SD[1..16],LED[1..3]

## Sheet 5 of 5
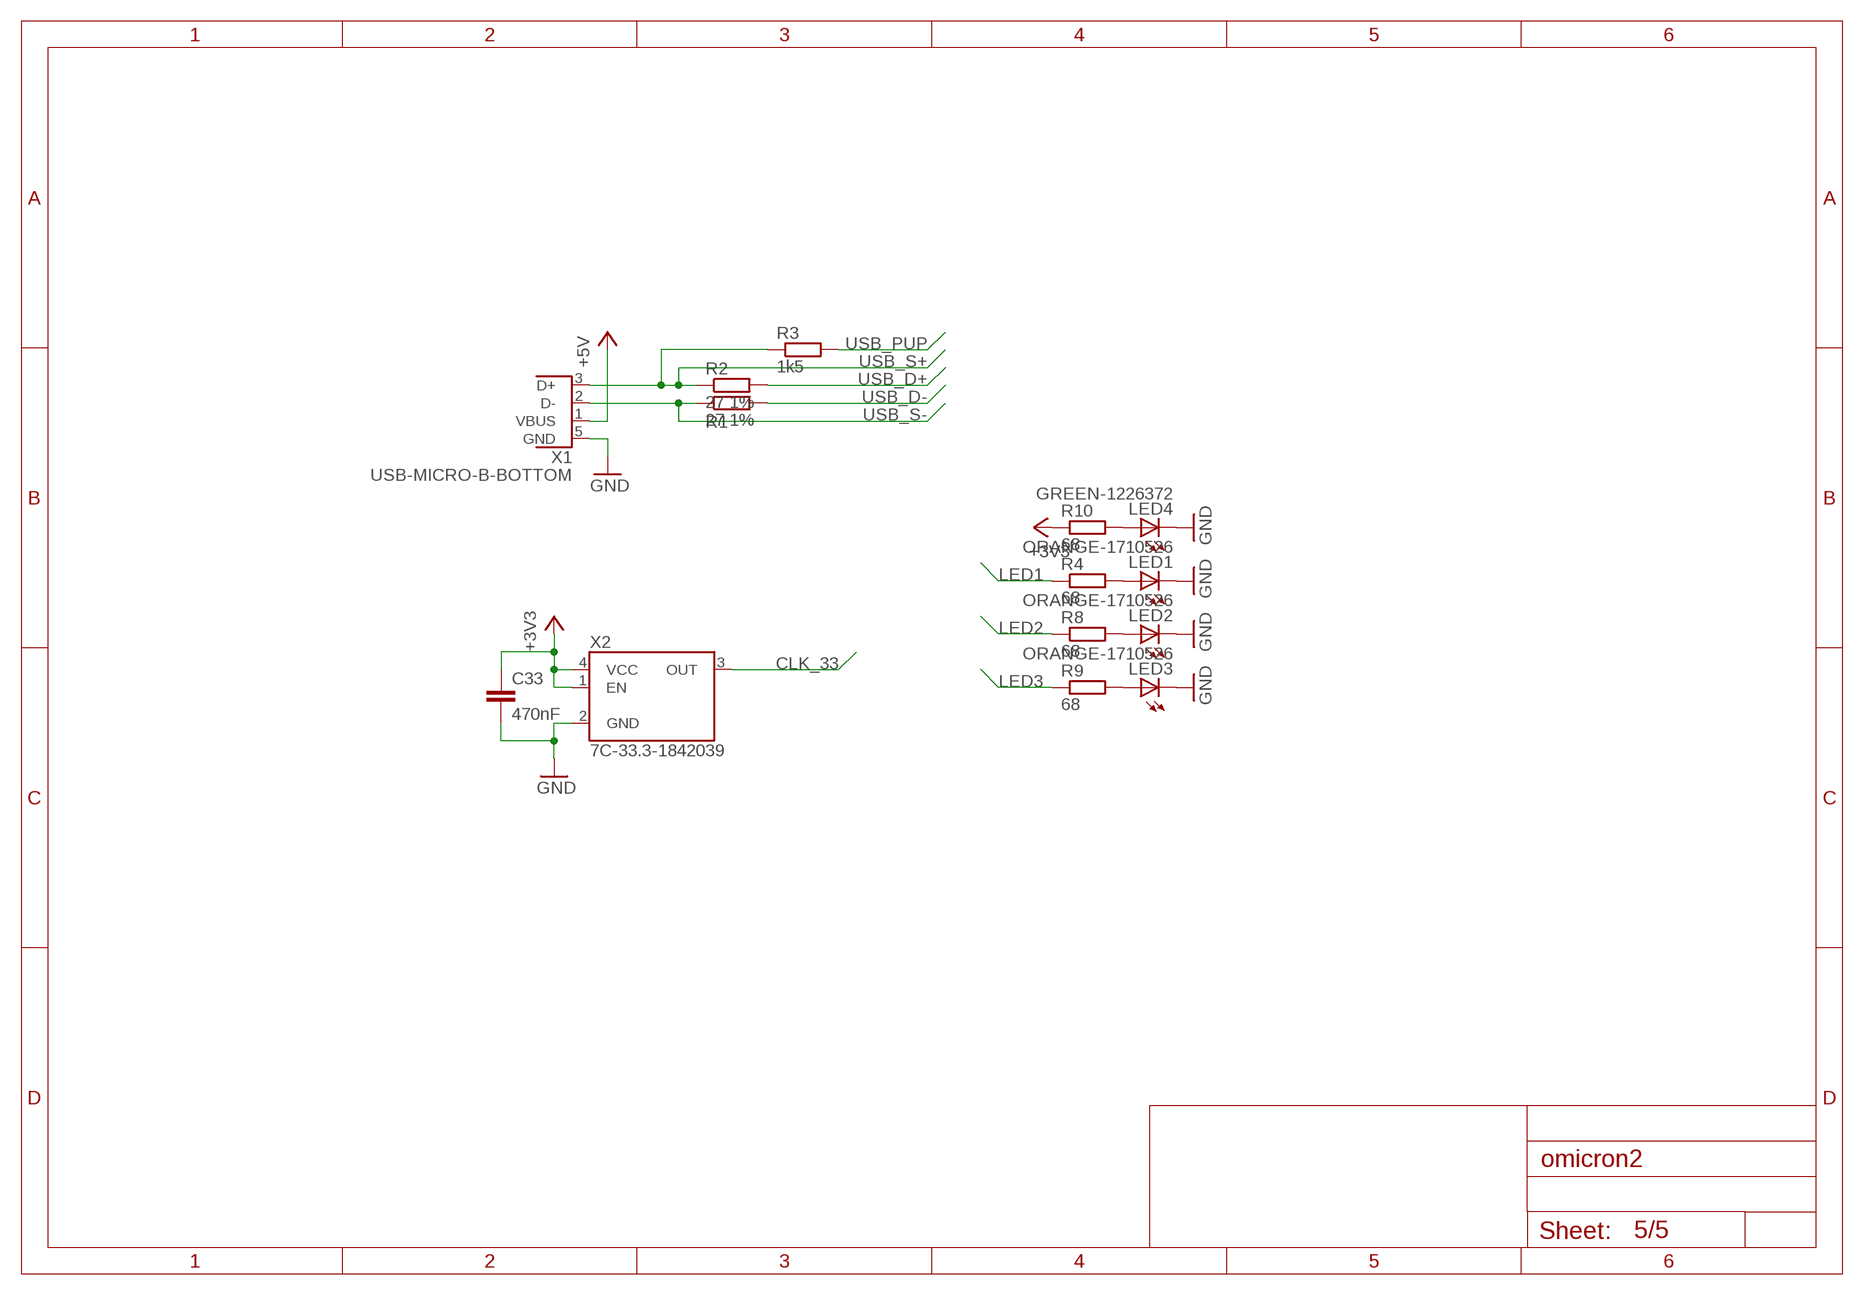
[diagram p4: schematic, sheet 5]

### Parts
C33  470nF  C-EUC0603  [C0603]
LED1  ORANGE-1710526  LEDCHIPLED_0603  [CHIPLED_0603]
LED2  ORANGE-1710526  LEDCHIPLED_0603  [CHIPLED_0603]
LED3  ORANGE-1710526  LEDCHIPLED_0603  [CHIPLED_0603]
LED4  GREEN-1226372  LEDCHIPLED_0603  [CHIPLED_0603]
R1  27 1%  R-EU_R0603  [R0603]
R2  27 1%  R-EU_R0603  [R0603]
R3  1k5  R-EU_R0603  [R0603]
R4  68  R-EU_R0603  [R0603]
R8  68  R-EU_R0603  [R0603]
R9  68  R-EU_R0603  [R0603]
R10  68  R-EU_R0603  [R0603]
X1  USB-MICRO-B-BOTTOM  [USB-MICRO-B-BOTTOM-MOLEX]
X2  7C-33.3-1842039  OSC-5X3.2HS  [5X3.2_HAND]

### Nets
+3V3: C33.1 R10.1 X2.1(EN) X2.4(VCC) ; also sheet 1,2,3,4
+5V: X1.1(VBUS) ; also sheet 1,2,3
CLK_33: X2.3(OUT) ; also sheet 4
GND: C33.2 LED1.C LED2.C LED3.C LED4.C X1.5(GND) X2.2(GND) ; also sheet 1,2,3,4
LED1: R4.1 ; also sheet 4
LED2: R8.1 ; also sheet 4
LED3: R9.1 ; also sheet 4
N$5: LED1.A R4.2
N$89: LED2.A R8.2
N$90: LED3.A R9.2
N$91: LED4.A R10.2
USB_D+: R2.2 ; also sheet 4
USB_D-: R1.2 ; also sheet 4
USB_PUP: R3.2 ; also sheet 4
USB_S+: R2.1 R3.1 X1.3(D+) ; also sheet 4
USB_S-: R1.1 X1.2(D-) ; also sheet 4

## Library data of the parts
C1-C43 = rcl:C-EU: CAPACITOR, European symbol
IC1 = xilinx:XC6SLX4*
IC2 IC6 = tps73033:TPS73033
IC3 = tps73033:LD6806TD/12H
IC4 = memory-micron:MT48LC64M4A2: 256Mb: x16 SDRAM MT48LC64M4A2 - 16 Meg x 4 x 4 banks Source: http://download.micron.com/pdf/datasheets/dram/sdram/256MSDRAM.pdf; OC_FARNELL: unknown; OC_NEWARK: unknown
IC5 = flash_memory:FLASH
JP1-JP10 JP97-JP128 = pinhead_smd:PINH1X01
L1-L3 = rcl:R-US_: RESISTOR, American symbol
LED1-LED5 = led:LED: LED OSRAM: - CHIPLED LG R971, LG N971, LY N971, LG Q971, LY Q971, LO R971, LY R971 LH N974, LH R974 LS Q976, LO Q976, LY Q976 LO Q996 - Hyper CHIPLED LW Q18S LB Q993, LB Q99A, LB R99A - SideLED LS A670, LO A670, LY A670, LG A670, LP A670 LB A673, LV A673, LT A673, LW A673 LH A674 LY A675 LS A676, LA A676, LO A676, LY A676, LW A676 LS A679, LY A679, LG A679 - Hyper Micro SIDELED® LS Y876, LA Y876, LO Y876, LY Y876 LT Y87S - SmartLED LW L88C, LW L88S LB L89C, LB L89S, LG L890 LS L89K, LO L89K, LY L89K LS L896, LA L896, LO L896, LY L896 - TOPLED LS T670, LO T670, LY T670, LG T670, LP T670 LSG T670, LSP T670, LSY T670, LOP T670, LYG T670 LG T671, LOG T671, LSG T671 LB T673, LV T673, LT T673, LW T673 LH T674 LS T676, LA T676, LO T676, LY T676, LB T676, LH T676, LSB T676, LW T676 LB T67C, LV T67C, LT T67C, LS T67K, LO T67K, LY T67K, LW E67C LS E67B, LA E67B, LO E67B, LY E67B, LB E67C, LV E67C, LT E67C LW T67C LS T679, LY T679, LG T679 LS T770, LO T770, LY T770, LG T770, LP T770 LB T773, LV T773, LT T773, LW T773 LH T774 LS E675, LA E675, LY E675, LS T675 LS T776, LA T776, LO T776, LY T776, LB T776 LHGB T686 LT T68C, LB T68C - Hyper Mini TOPLED® LB M676 - Mini TOPLED Santana® LG M470 LS M47K, LO M47K, LY M47K Source: http://www.osram.convergy.de LUXEON: - LUMILED® LXK2-PW12-R00, LXK2-PW12-S00, LXK2-PW14-U00, LXK2-PW14-V00 LXK2-PM12-R00, LXK2-PM12-S00, LXK2-PM14-U00 LXK2-PE12-Q00, LXK2-PE12-R00, LXK2-PE12-S00, LXK2-PE14-T00, LXK2-PE14-U00 LXK2-PB12-K00, LXK2-PB12-L00, LXK2-PB12-M00, LXK2-PB14-N00, LXK2-PB14-P00, LXK2-PB14-Q00 LXK2-PR12-L00, LXK2-PR12-M00, LXK2-PR14-Q00, LXK2-PR14-R00 LXK2-PD12-Q00, LXK2-PD12-R00, LXK2-PD12-S00 LXK2-PH12-R00, LXK2-PH12-S00 LXK2-PL12-P00, LXK2-PL12-Q00, LXK2-PL12-R00 Source: www.luxeon.com KINGBRIGHT: KA-3528ASYC Source: www.kingbright.com
Q1 Q3 = transistors:NPN-BIAS
Q2 Q4 = transistor-pnp:BC807*: PNP Transistror
R1-R63 = rcl:R-EU_: RESISTOR, European symbol
TP1-TP3 TP8-TP10 TP13-TP16 = testpad:TP: Test pad
TR1-TR16 = 74lvc1t45:74*1T45
U$1 = pic10f320:PIC10*
X1 = usb:USB
X2 = xtal:OSC